# Altium project DiodeLadderFilter.PrjPcb
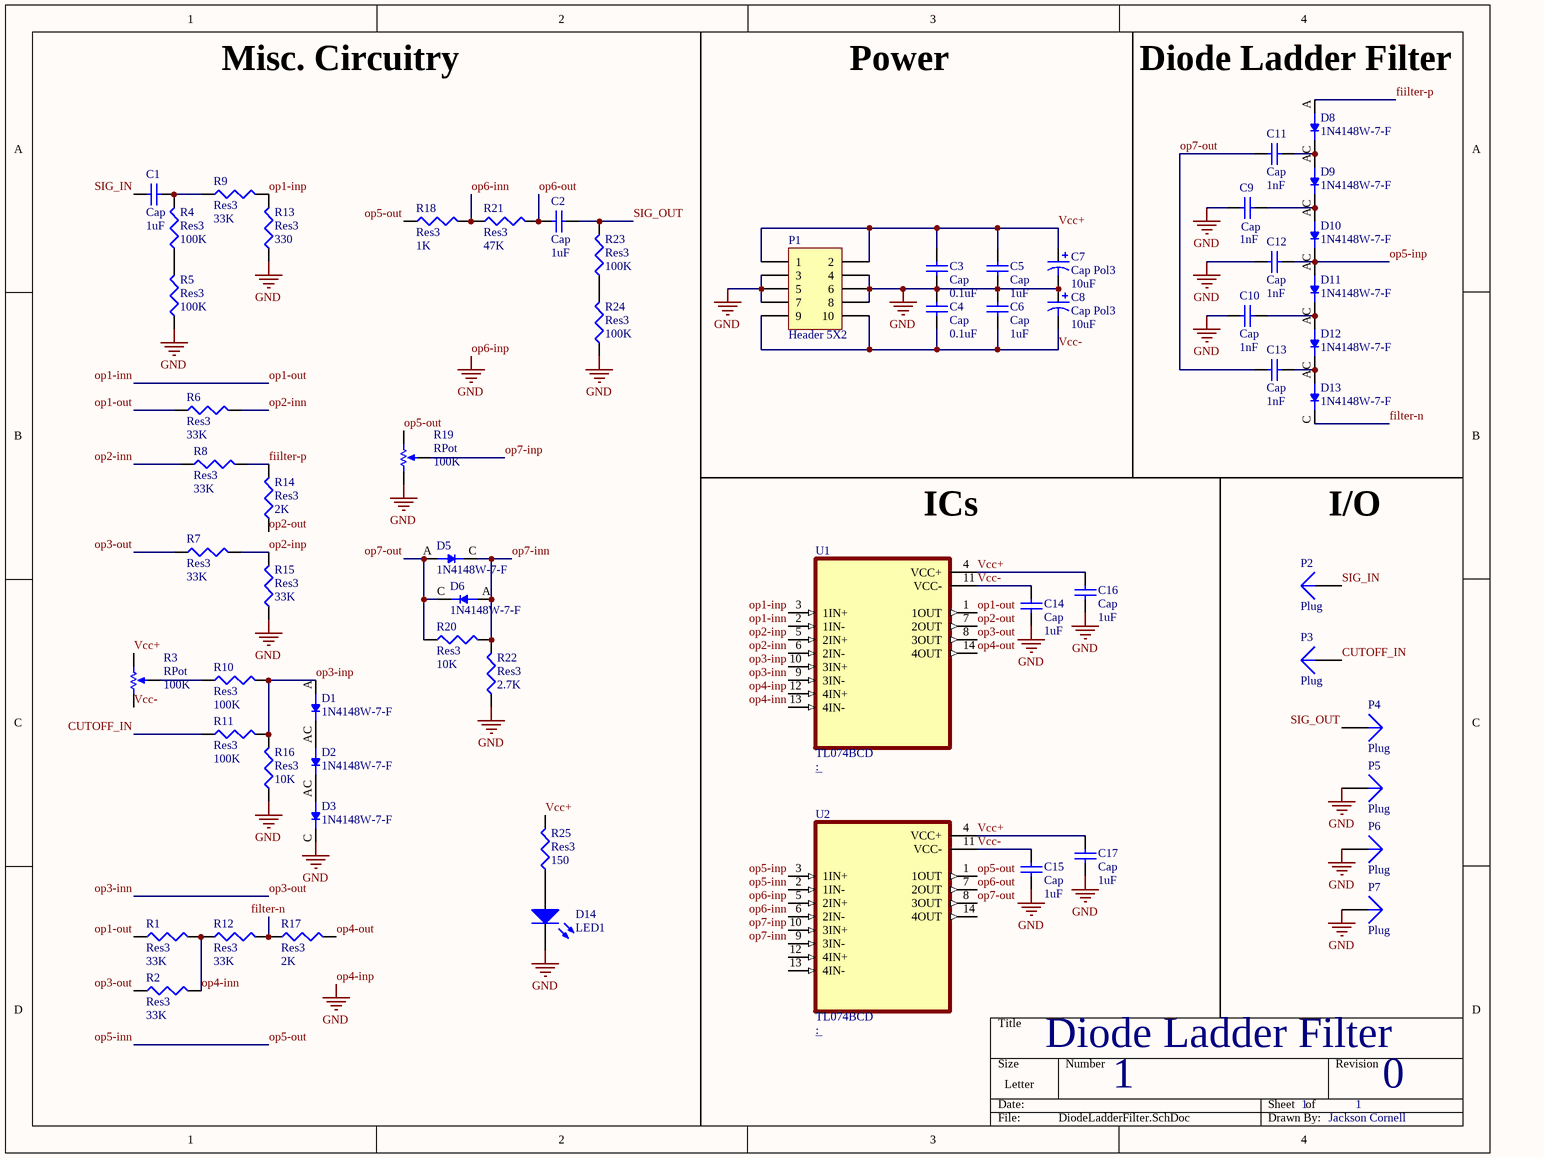
[diagram p0: DiodeLadderFilter.SchDoc]
1 sheet, 63 parts. Net scope: global (net labels, ports and power ports of the same name join across sheets).
Board file: DiodeLadderFilter.PcbDoc

## Sheet DiodeLadderFilter.SchDoc
size Letter

### Parts
C1  Cap  value 1uF  [CAPC1608X90]
C2  Cap  value 1uF  [CAPC1608X90]
C3  Cap  value 0.1uF  [CAPC1608X90]
C4  Cap  value 0.1uF  [CAPC1608X90]
C5  Cap  value 1uF  [CAPC1608X90]
C6  Cap  value 1uF  [CAPC1608X90]
C7  Cap Pol3  value 10uF  [2220]
C8  Cap Pol3  value 10uF  [2220]
C9  Cap  value 1nF  [CAPC1608X90]
C10  Cap  value 1nF  [CAPC1608X90]
C11  Cap  value 1nF  [CAPC1608X90]
C12  Cap  value 1nF  [CAPC1608X90]
C13  Cap  value 1nF  [CAPC1608X90]
C14  Cap  value 1uF  [CAPC1608X90]
C15  Cap  value 1uF  [CAPC1608X90]
C16  Cap  value 1uF  [CAPC1608X90]
C17  Cap  value 1uF  [CAPC1608X90]
D1  1N4148W-7-F  [SODFL1608X70N]
D2  1N4148W-7-F  [SODFL1608X70N]
D3  1N4148W-7-F  [SODFL1608X70N]
D5  1N4148W-7-F  [SODFL1608X70N]
D6  1N4148W-7-F  [SODFL1608X70N]
D8  1N4148W-7-F  [SODFL1608X70N]
D9  1N4148W-7-F  [SODFL1608X70N]
D10  1N4148W-7-F  [SODFL1608X70N]
D11  1N4148W-7-F  [SODFL1608X70N]
D12  1N4148W-7-F  [SODFL1608X70N]
D13  1N4148W-7-F  [SODFL1608X70N]
D14  LED1  [LED-1]
P1  Header 5X2  [HDR2X5]
P2  Plug  [PIN1]
P3  Plug  [PIN1]
P4  Plug  [PIN1]
P5  Plug  [PIN1]
P6  Plug  [PIN1]
P7  Plug  [PIN1]
R1  Res3  value 33K  [J1-0603]
R2  Res3  value 33K  [J1-0603]
R3  RPot  value 100K  [VR5]
R4  Res3  value 100K  [J1-0603]
R5  Res3  value 100K  [J1-0603]
R6  Res3  value 33K  [J1-0603]
R7  Res3  value 33K  [J1-0603]
R8  Res3  value 33K  [J1-0603]
R9  Res3  value 33K  [J1-0603]
R10  Res3  value 100K  [J1-0603]
R11  Res3  value 100K  [J1-0603]
R12  Res3  value 33K  [J1-0603]
R13  Res3  value 330  [J1-0603]
R14  Res3  value 2K  [J1-0603]
R15  Res3  value 33K  [J1-0603]
R16  Res3  value 10K  [J1-0603]
R17  Res3  value 2K  [J1-0603]
R18  Res3  value 1K  [J1-0603]
R19  RPot  value 100K  [VR5]
R20  Res3  value 10K  [J1-0603]
R21  Res3  value 47K  [J1-0603]
R22  Res3  value 2.7K  [J1-0603]
R23  Res3  value 100K  [J1-0603]
R24  Res3  value 100K  [J1-0603]
R25  Res3  value 150  [J1-0603]
U1  TL074BCD  [SOIC127P600X175-14N]
U2  TL074BCD  [SOIC127P600X175-14N]

### Nets
op4-inp: C3.1 C4.2 C5.1 C6.2 C7.2 C8.1 C9.1 C10.1 C12.1 C14.1 C15.1 C16.1 C17.1 D3.C(K) D14.2(K) P1.3 P1.4 P1.5 P1.6 P1.7 P1.8 P5.1 P6.1 P7.1 R5.1 R13.1 R15.1 R16.1 R19.1(TOP) R22.1 R24.1 U1.12(4IN+) U2.5(2IN+)  [also labelled GND, op6-inp]
CUTOFF_IN: P3.1 R11.1
fiilter-p: D8.A R8.2 R14.2
filter-n: D13.C(K) R12.2 R17.1
op1-inn: R1.1 R6.1 U1.1(1OUT) U1.2(1IN-)  [also labelled op1-out]
op1-inp: R9.2 R13.2 U1.3(1IN+)
op2-inn: R6.2 R8.1 U1.6(2IN-)
op2-inp: R7.2 R15.2 U1.5(2IN+)
op2-out: R14.1 U1.7(2OUT)
op3-inn: R2.1 R7.1 U1.8(3OUT) U1.9(3IN-)  [also labelled op3-out]
op3-inp: D1.A R10.2 R11.2 R16.2 U1.10(3IN+)
op4-inn: R1.2 R2.2 R12.1 U1.13(4IN-)
op4-out: R17.2 U1.14(4OUT)
op5-inn: R18.1 R19.2(BOT) U2.1(1OUT) U2.2(1IN-)  [also labelled op5-out]
op5-inp: C12.2 D10.C(K) D11.A U2.3(1IN+)
op6-inn: R18.2 R21.1 U2.6(2IN-)
op6-out: C2.1 R21.2 U2.7(2OUT)
op7-inn: D5.C(K) D6.A R20.2 R22.2 U2.9(3IN-)
op7-inp: R19.3(TAP) U2.10(3IN+)
op7-out: C11.1 C13.1 D5.A D6.C(K) R20.1 U2.8(3OUT)
SIG_IN: C1.1 P2.1
SIG_OUT: C2.2 P4.1 R23.2
Vcc+: C3.2 C5.2 C7.1 C16.2 C17.2 P1.1 P1.2 R3.2(BOT) R25.2 U1.4(VCC+) U2.4(VCC+)
Vcc-: C4.1 C6.1 C8.2 C14.2 C15.2 P1.9 P1.10 R3.1(TOP) U1.11(VCC-) U2.11(VCC-)
NetC1_2: C1.2 R4.2 R9.1
NetC9_2: C9.2 D9.C(K) D10.A
NetC10_2: C10.2 D11.C(K) D12.A
NetC11_2: C11.2 D8.C(K) D9.A
NetC13_2: C13.2 D12.C(K) D13.A
NetD1_C: D1.C(K) D2.A
NetD2_C: D2.C(K) D3.A
NetD14_1: D14.1(A) R25.1
NetR3_3: R3.3(TAP) R10.1
NetR4_1: R4.1 R5.2
NetR23_1: R23.1 R24.2

Not connected (* = marked no-connect by the designer): U2 12(4IN+) 13(4IN-) 14(4OUT)

### Notes on the sheet
- Misc. Circuitry
- Power
- (near D8) Diode Ladder Filter
- (near U1) ICs
- I/O
- Diode Ladder Filter
- 1
- 0
- Jackson Cornell

### Library data of the parts
C1-C6 C9-C17 = Cap: Capacitor; Published: 8-Jun-2000; LatestRevisionDate: 17-Jul-2002; LatestRevisionNote: Re-released for DXP Platform.; PackageReference: RAD-0.3; Publisher: Altium Limited; PackageDescription: Radial Cap, Thru-Hole; 2 Leads; 0.3 in Pin Spacing
C7 C8 = Cap Pol3: Polarized Capacitor (Surface Mount); Published: 8-Jun-2000; LatestRevisionDate: 29-May-2009; LatestRevisionNote: IPC-7351 Footprint Added.; PackageReference: C0805; Publisher: Altium Limited; PackageDescription: Chip Capacitor
D1-D3 D5 D6 D8-D13 = 1N4148W-7-F: Diode Standard 100V 300mA _DC_ Surface Mount SOD-123; MF: Diodes Inc.; Price: None; Package: SOD-123 Diodes Inc.; Value: *; MP: 1N4148W-7-F; Availability: Unavailable; SnapEDA_Link: https://www.snapeda.com/parts/1N4148W-7-F/Diodes%20Inc./view-part/16/?ref=snap
D14 = LED1: Typical RED GaAs LED; Published: 8-Jun-2000; LatestRevisionDate: 08-Jul-2005; LatestRevisionNote: Mech Layer 1 removed.; PackageReference: LED-1; Publisher: Altium Limited; PackageDescription: LED; 2 Leads
P1 = Header 5X2: Header, 5-Pin, Dual row; LatestRevisionDate: 17-Jul-2002; LatestRevisionNote: Re-released for DXP Platform.; Publisher: Altium Limited
R1 R2 R4-R18 R20-R25 = Res3: Resistor; Published: 8-Jun-2000; LatestRevisionDate: 29-May-2009; LatestRevisionNote: IPC-7351 Footprint Added.; PackageReference: J1-0603; Publisher: Altium Limited; PackageDescription: Chip Resistor
R3 R19 = RPot: Potentiometer; Sim Note: Enter the Resistance value and the set point into parameter fields.; Set Position: 0.5; Published: 8-Jun-2000; LatestRevisionDate: 17-Jul-2002; LatestRevisionNote: Re-released for DXP Platform.; PackageReference: VR5; Publisher: Altium Limited; PackageDescription: Variable Resistor, Thru-Hole; 3 Leads
U1 U2 = TL074BCD: Quad low-noise JFET-input low offset operational amplifier 14-SOIC 0 to 70; MF: Texas Instruments; Texas_Instruments-Purchase-URL: https://snapeda.com/shop?store=Texas+Instruments&id=327414; Value: *; Availability: Good; SnapEDA_Link: https://www.snapeda.com/parts/TL074BCD/Texas%20Instruments/view-part/327414/?ref=snap; Mouser-Purchase-URL: https://snapeda.com/shop?store=Mouser&id=327414; Package: SOIC-14 Texas Instruments; DigiKey-Purchase-URL: https://snapeda.com/shop?store=DigiKey&id=327414; MP: TL074BCD; Arrow_Asia-Purchase-URL: https://snapeda.com/shop?store=Arrow+Asia&id=327414; Price: None
P2-P7 = Plug: LatestRevisionDate: 17-Jul-2002; LatestRevisionNote: Re-released for DXP Platform.; Publisher: Altium Limited